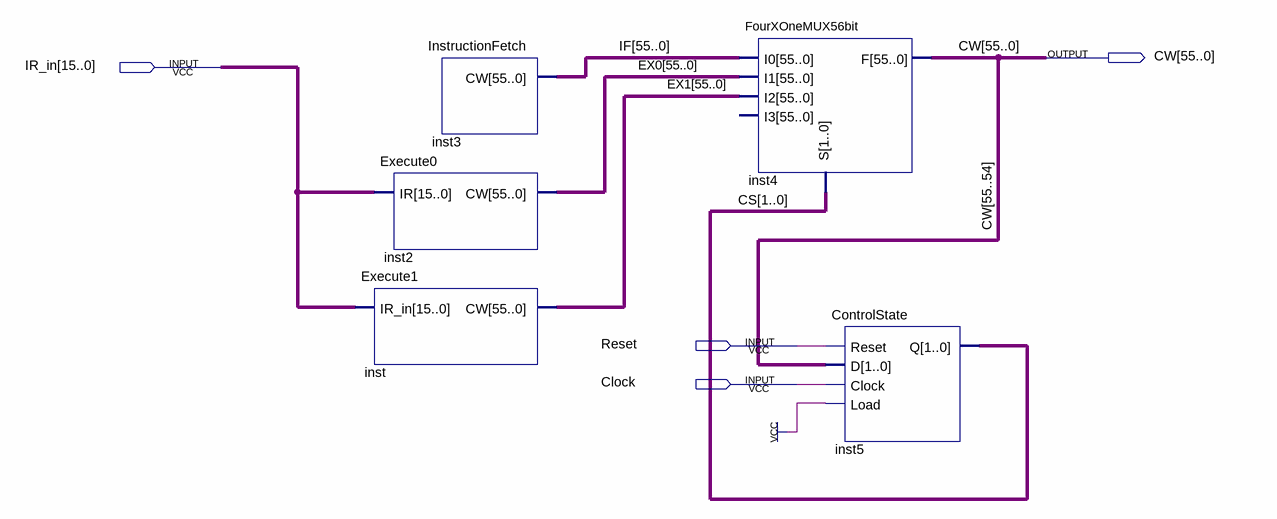
[diagram p0: schematic sheet]
// Quartus schematic ControlUnit.bdf as structural Verilog: 5 symbols, 4 pins
module ControlUnit (
  input  [15:0] IR_in,
  input  Reset,
  input  Clock,
  output [55:0] CW
);

  wire [1:0] CS;
  wire [55:0] EX0, EX1, IF;

  Execute0 inst2 (.IR(IR_in), .CW(EX0));
  Execute1 inst (.IR_in(IR_in), .CW(EX1));
  InstructionFetch inst3 (.CW(IF));
  FourXOneMUX56bit inst4 (.I0(IF), .I1(EX0), .I2(EX1), .S(CS), .F(CW));  // open: I3
  ControlState inst5 (.Reset(Reset), .D(CW[55:54]), .Clock(Clock), .Load(1'b1), .Q(CS));
endmodule
